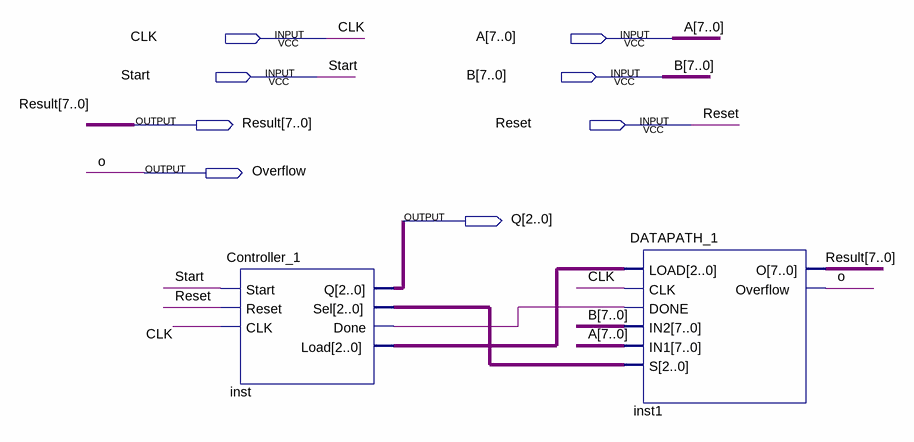
[diagram p0: schematic sheet]
// Quartus schematic Bai1.bdf as structural Verilog: 2 symbols, 8 pins
module Bai1 (
  input  CLK,
  input  [7:0] A,
  input  Start,
  input  [7:0] B,
  input  Reset,
  output [7:0] Result,
  output Overflow,
  output [2:0] Q
);

  wire inst_done;
  wire [2:0] inst_load, inst_sel;

  Controller_1 inst (
    .Start(Start), .Reset(Reset), .CLK(CLK), .Q(Q), .Sel(inst_sel), .Done(inst_done), .Load(inst_load));
  DATAPATH_1 inst1 (
    .LOAD(inst_load), .CLK(CLK), .DONE(inst_done), .IN2(B), .IN1(A), .S(inst_sel), .O(Result),
    .Overflow(Overflow));

  // Other names for the same wires on the sheet: o = Overflow
endmodule
